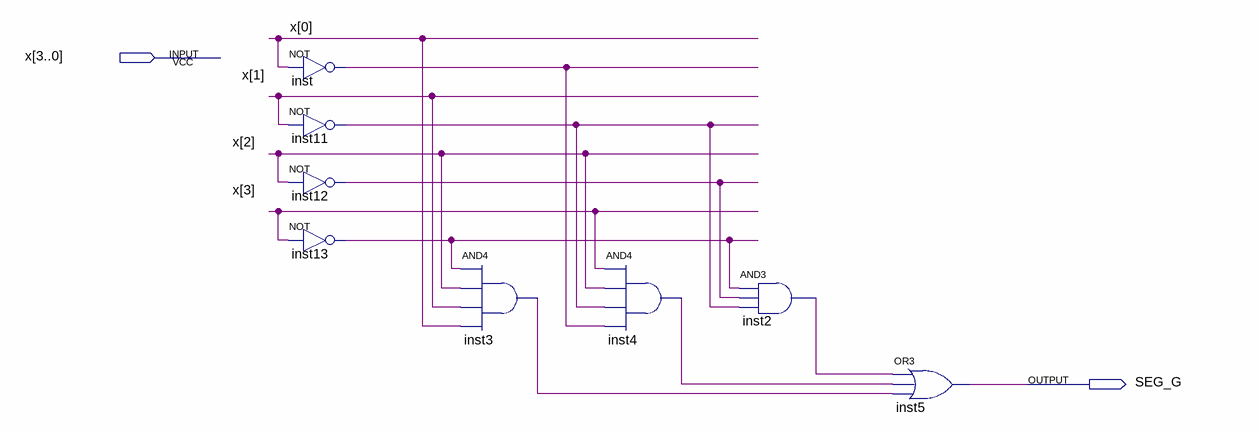
[diagram p0: schematic sheet]
// Quartus schematic SEG_G.bdf as structural Verilog: 8 symbols, 2 pins
module SEG_G (
  input  [3:0] x,
  output SEG_G
);

  wire inst2_out, inst3_out, inst4_out, inst11_out, inst12_out, inst13_out, inst_out;

  not inst (inst_out, x[0]);
  not inst11 (inst11_out, x[1]);
  not inst12 (inst12_out, x[2]);
  not inst13 (inst13_out, x[3]);
  and inst3 (inst3_out, inst13_out, x[2], x[1], x[0]);
  and inst4 (inst4_out, x[3], x[2], inst11_out, inst_out);
  and inst2 (inst2_out, inst13_out, inst12_out, inst11_out);
  or inst5 (SEG_G, inst2_out, inst4_out, inst3_out);
endmodule
